# EAGLE design 406MHz detector (EAGLE 9.3.0)
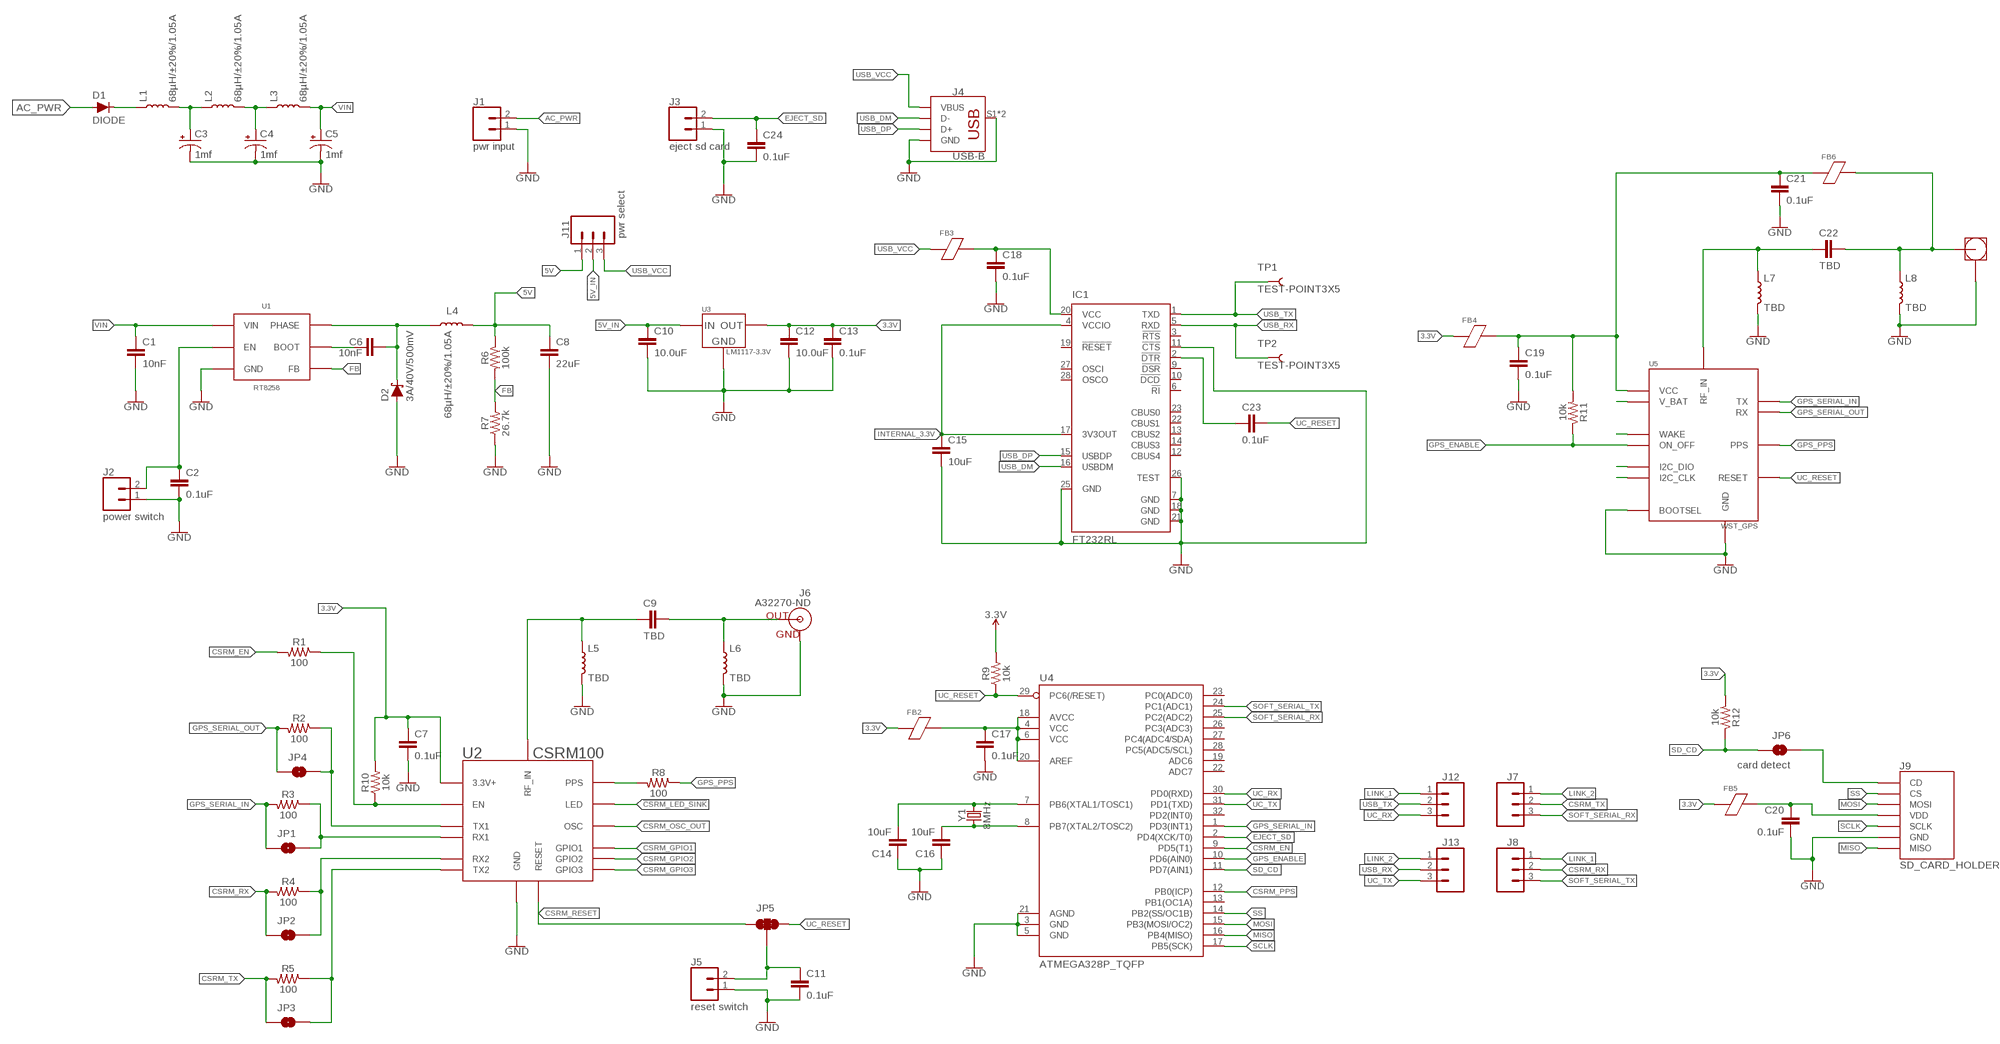
[diagram p0: schematic, sheet 1]

## Parts
C1  10nF  10NF-0603-50V-10%  [0603]
C2  0.1uF  0.18UF-0603-10V-10%  [0603]
C3  1mf  1000UF-RADIAL-5MM-35V-20%-KIT  [CPOL-RADIAL-5MM-10MM-KIT]
C4  1mf  1000UF-RADIAL-5MM-35V-20%-KIT  [CPOL-RADIAL-5MM-10MM-KIT]
C5  1mf  1000UF-RADIAL-5MM-35V-20%-KIT  [CPOL-RADIAL-5MM-10MM-KIT]
C6  10nF  10NF-0603-50V-10%  [0603]
C7  0.1uF  0.18UF-0603-10V-10%  [0603]
C8  22uF  0.18UF-0603-10V-10%  [0603]
C9  TBD  0.1UF-0603-25V-5%  [0603]
C10  10.0uF  1.0UF-1206-50V-10%  [1206]
C11  0.1uF  0.18UF-0603-10V-10%  [0603]
C12  10.0uF  1.0UF-1206-50V-10%  [1206]
C13  0.1uF  0.18UF-0603-10V-10%  [0603]
C14  10uF  10UF-1206-6.3V-20%  [1206]
C15  10uF  10UF-1206-6.3V-20%  [1206]
C16  10uF  10UF-1206-6.3V-20%  [1206]
C17  0.1uF  0.18UF-0603-10V-10%  [0603]
C18  0.1uF  0.18UF-0603-10V-10%  [0603]
C19  0.1uF  0.18UF-0603-10V-10%  [0603]
C20  0.1uF  0.18UF-0603-10V-10%  [0603]
C21  0.1uF  0.18UF-0603-10V-10%  [0603]
C22  TBD  0.1UF-0603-25V-5%  [0603]
C23  0.1uF  0.18UF-0603-10V-10%  [0603]
C24  0.1uF  0.18UF-0603-10V-10%  [0603]
D1  DIODE  [SMA-DIODE]
D2  3A/40V/500mV  DIODE-SCHOTTKY-B340A  [SMA-DIODE]
FB2  FERRITE_BEAD  [0603]
FB3  FERRITE_BEAD  [0603]
FB4  FERRITE_BEAD  [0603]
FB5  FERRITE_BEAD  [0603]
FB6  FERRITE_BEAD  [0603]
IC1  FT232RL  [SSOP28]
J1  pwr input  CONN_02LOCK  [1X02_LOCK]
J2  power switch  CONN_02  [1X02]
J3  eject sd card  CONN_02  [1X02]
J4  USB-B  [USB]
J5  reset switch  CONN_02  [1X02]
J6  A32270-ND  [A33270-ND]
J7  select jumper  CONN_03LOCK  [1X03_LOCK]
J8  select jumper  CONN_03LOCK  [1X03_LOCK]
J9  SD_CARD_HOLDER  [SD_CARD_HOLDER]
J10  SMA  [SMA_R/A]
J11  pwr select  CONN_03LOCK  [1X03_LOCK]
J12  select jumper  CONN_03LOCK  [1X03_LOCK]
J13  select jumper  CONN_03LOCK  [1X03_LOCK]
JP1  JUMPER-SMT_2_NO_SILK_ROUND  [SMT-JUMPER_2_NO_SILK_ROUND]
JP2  JUMPER-SMT_2_NO_SILK_ROUND  [SMT-JUMPER_2_NO_SILK_ROUND]
JP3  JUMPER-SMT_2_NO_SILK_ROUND  [SMT-JUMPER_2_NO_SILK_ROUND]
JP4  JUMPER-SMT_2_NO_SILK_ROUND  [SMT-JUMPER_2_NO_SILK_ROUND]
JP5  JUMPER-SMT_3_2-NC_TRACE_SILK  [SMT-JUMPER_3_2-NC_TRACE_SILK]
JP6  card detect  JUMPER-SMT_2_NO_SILK  [SMT-JUMPER_2_NO_SILK]
L1  68µH/±20%/1.05A  INDUCTOR-CR75-68UH  [CR75]
L2  68µH/±20%/1.05A  INDUCTOR-CR75-68UH  [CR75]
L3  68µH/±20%/1.05A  INDUCTOR-CR75-68UH  [CR75]
L4  68µH/±20%/1.05A  INDUCTOR-CR75-68UH  [CR75]
L5  TBD  INDUCTOR-0603-33NH  [0603]
L6  TBD  INDUCTOR-0603-33NH  [0603]
L7  TBD  INDUCTOR-0603-33NH  [0603]
L8  TBD  INDUCTOR-0603-33NH  [0603]
R1  100  10KOHM-0603-1/10W-1%  [0603]
R2  100  10KOHM-0603-1/10W-1%  [0603]
R3  100  10KOHM-0603-1/10W-1%  [0603]
R4  100  10KOHM-0603-1/10W-1%  [0603]
R5  100  10KOHM-0603-1/10W-1%  [0603]
R6  100k  10KOHM-0603-1/10W-1%  [0603]
R7  26.7k  26.7KOHM0603-1/10W-1%  [0603]
R8  100  10KOHM-0603-1/10W-1%  [0603]
R9  10k  10KOHM-0603-1/10W-1%  [0603]
R10  10k  10KOHM-0603-1/10W-1%  [0603]
R11  10k  10KOHM-0603-1/10W-1%  [0603]
R12  10k  10KOHM-0603-1/10W-1%  [0603]
TP1  TEST-POINT3X5  [PAD.03X.05]
TP2  TEST-POINT3X5  [PAD.03X.05]
U1  RT8258  [SOT23-6]
U2  CSRM100  [CSRM]
U3  LM1117-3.3V  [SOT223]
U4  ATMEGA328P_TQFP  [TQFP32-08]
U5  WST_GPS  [WST_GPS]
Y1  8MHz  CRYSTAL-8MHZSMD-HC49UP  [HC49UP]

## Nets
3.3V: C7.1 C12.1 C13.1 FB2.1 FB4.1 FB5.1 R9.2 R10.2 R12.2 U2.PWR_IN(3.3V+) U3.2(VOUT) U3.4(VOUT)
5V: C8.1 J11.1 L4.P$2 R6.1
5V_IN: C10.1 J11.2 U3.3(VIN)
406_IN [RF]: C9.2 L5.1 U2.406_IN(RF_IN)
!CSRM_LED_SINK: U2.LED
AC_PWR: D1.A J1.2
ANTENNA_CONNECTOR [RF]: C9.1 J6.OUT L6.1
BOOT: C6.1 U1.1(BOOT)
CSRM_EN: R1.2 U4.9(PD5(T1))
CSRM_GPIO1: U2.GPIO1
CSRM_GPIO2: U2.GPIO2
CSRM_GPIO3: U2.GPIO3
CSRM_OSC_OUT: U2.OSC_OUT(OSC)
CSRM_PPS: R8.2 U2.PPS U4.12(PB0(ICP))
CSRM_RESET: JP5.1 U2._RESET(RESET)
CSRM_RX: J8.2 JP2.1 R4.2
CSRM_TX: J7.2 JP3.1 R5.2
EJECT_SD: C24.1 J3.2 U4.2(PD4(XCK/T0))
FB: R6.2 R7.2 U1.3(FB)
GND: C1.2 C2.2 C3.- C4.- C5.- C7.2 C8.2 C10.2 C11.2 C12.2 C13.2 C14.1 C15.2 C16.1 C17.2 C18.2 C19.2 C20.2 C21.2 C24.2 D2.A IC1.7(GND) IC1.11(!CTS) IC1.18(GND) IC1.21(GND) IC1.25(GND) IC1.26(TEST) J1.1 J2.1 J3.1 J4.4(GND) J4.S1(SHIELD) J4.S2(SHIELD) J5.1 J6.GND1(GND) J6.GND2(GND) J6.GND3(GND) J6.GND4(GND) J9.GND1(GND) J9.GND2(GND) J9.P6(GND) J10.P$2 J10.P$3 J10.P$4 J10.P$5 L5.2 L6.2 L7.2 L8.2 R7.1 U1.2(GND) U2.GND U2.GND1(GND) U2.GND2(GND) U2.GND3(GND) U2.GND4(GND) U3.1(GND) U4.3(GND) U4.5(GND) U4.21(AGND) U5.P$1(GND) U5.P$3(GND) U5.P$9(BOOTSEL) U5.P$17(GND) U5.P$18(GND) U5.P$19(GND)
GPS_ANTENNA [RF]: C22.2 L7.1 U5.P$2(RF_IN)
GPS_CONNECTOR [RF]: C22.1 FB6.2 J10.P$1 L8.1
GPS_ENABLE: R11.1 U4.10(PD6(AIN0)) U5.P$15(ON_OFF)
GPS_PPS: R8.1 U5.P$14(PPS)
GPS_SERIAL_IN: JP1.1 R3.2 U4.1(PD3(INT1)) U5.P$10(TX)
GPS_SERIAL_OUT: JP4.1 R2.2 U5.P$11(RX)
HF_SWITCH: C6.2 D2.C L4.P$1 U1.6(PHASE)
INTERNAL_3.3V: C15.1 IC1.4(VCCIO) IC1.17(3V3OUT)
LINK_1: J8.1 J12.1
LINK_2: J7.1 J13.1
MISO: J9.P7(MISO) U4.16(PB4(MISO))
MOSI: J9.P3(MOSI) U4.15(PB3(MOSI/OC2))
N$1: JP4.2 R2.1 U2.TX1
N$4: JP1.2 R3.1 U2.RX1
N$5: JP2.2 R4.1 U2.RX2
N$6: JP3.2 R5.1 U2.TX2
N$8: R1.1 R10.1 U2.EN
N$10: C23.1 IC1.2(!DTR)
N$11: U5.P$6(V_BAT)
N$12: U5.P$16(WAKE)
N$13: J9.CD1(CD) J9.CD2(CD) JP6.1
N$14: U5.P$12(I2C_DIO)
N$15: D1.C L1.P$1
N$16: C3.+ L1.P$2 L2.P$1
N$17: C4.+ L2.P$2 L3.P$1
N$18: U5.P$13(I2C_CLK)
N$20: C18.1 FB3.1 IC1.20(VCC)
N$21: C14.2 U4.7(PB6(XTAL1/TOSC1)) Y1.2
N$22: C16.2 U4.8(PB7(XTAL2/TOSC2)) Y1.1
N$29: C19.1 C21.1 FB4.2 FB6.1 R11.2 U5.P$5(VCC)
N$31: C17.1 FB2.2 U4.4(VCC) U4.6(VCC) U4.18(AVCC) U4.20(AREF)
N$45: C20.1 FB5.2 J9.P4(VDD)
RESET: C11.1 J5.2 JP5.2
SCLK: J9.P5(SCLK) U4.17(PB5(SCK))
SD_CD: JP6.2 R12.1 U4.11(PD7(AIN1))
SOFT_SERIAL_RX: J7.3 U4.25(PC2(ADC2))
SOFT_SERIAL_TX: J8.3 U4.24(PC1(ADC1))
SS: J9.P2(CS) U4.14(PB2(SS/OC1B))
SUPPLY_ENABLE: C2.1 J2.2 U1.4(EN)
UC_RESET: C23.2 JP5.3 R9.1 U4.29(PC6(/RESET)) U5.P$4(RESET)
UC_RX: J12.3 U4.30(PD0(RXD))
UC_TX: J13.3 U4.31(PD1(TXD))
USB_DM: IC1.16(USBDM) J4.2(D-)
USB_DP: IC1.15(USBDP) J4.3(D+)
USB_RX: IC1.5(RXD) J13.2 TP2.P$1
USB_TX: IC1.1(TXD) J12.2 TP1.P$1
USB_VCC: FB3.2 J4.1(VBUS) J11.3
VIN: C1.1 C5.+ L3.P$2 U1.5(VIN)
Unconnected: IC1.3(!RTS) IC1.6(!RI) IC1.9(!DSR) IC1.10(!DCD) IC1.12(CBUS4) IC1.13(CBUS2) IC1.14(CBUS3) IC1.19(!RESET) IC1.22(CBUS1) IC1.23(CBUS0) IC1.27(OSCI) IC1.28(OSCO) U4.13(PB1(OC1A)) U4.19(ADC6) U4.22(ADC7) U4.23(PC0(ADC0)) U4.26(PC3(ADC3)) U4.27(PC4(ADC4/SDA)) U4.28(PC5(ADC5/SCL)) U4.32(PD2(INT0))

## Library data of the parts
C1 C6 = SparkFun-Capacitors:10NF: 0.01uF/10nF/10,000pF ceramic capacitors A capacitor is a passive two-terminal electrical component used to store electrical energy temporarily in an electric field. CAP-09321; PROD_ID: CAP-00867
C2 C7 C8 C11 C13 C17-C21 C23 C24 = SparkFun-Capacitors:0.18UF: 0.18µF ceramic capacitor A capacitor is a passive two-terminal electrical component used to store electrical energy temporarily in an electric field.; PROD_ID: CAP-12380; VALUE: 0.18uF
C3-C5 = SparkFun-Capacitors:1000UF: 1,000µF/1mF ceramic capacitors A capacitor is a passive two-terminal electrical component used to store electrical energy temporarily in an electric field. CAP-08070; PROD_ID: CAP-09538
C9 C22 = SparkFun-Capacitors:0.1UF: 0.1µF ceramic capacitors A capacitor is a passive two-terminal electrical component used to store electrical energy temporarily in an electric field.; PROD_ID: CAP-08604; VALUE: 0.1uF
C10 C12 = SparkFun-Capacitors:1.0UF: 1µF ceramic capacitors A capacitor is a passive two-terminal electrical component used to store electrical energy temporarily in an electric field.; PROD_ID: CAP-09822; VALUE: 1.0uF
C14-C16 = SparkFun-Capacitors:10UF: 10.0µF ceramic capacitors A capacitor is a passive two-terminal electrical component used to store electrical energy temporarily in an electric field.; PROD_ID: CAP-10057
D1 = capstone:DIODE
D2 = SparkFun-DiscreteSemi:DIODE-SCHOTTKY: Schottky diode A Schottky diode is a semiconductor diode which has a low forward voltage drop and a very fast switching action.; PROD_ID: DIO-09886
FB2-FB6 = capstone:FERRITE_BEAD: HZ0603B112R-10
IC1 = ftdichip:FT232R: Source: http://www.ftdichip.com/Documents/DataSheets/DS_FT232R_v104.pdf; MPN: FT232RL; OC_FARNELL: 1146032; OC_NEWARK: 91K9918
J1-J3 J5 = SparkFun-Connectors:CONN_02: Multi connection point. Often used as Generic Header-pin footprint for 0.1 inch spaced/style header connections On any of the 0.1 inch spaced packages, you can populate with these: Break Away Headers - Straight <https://www.sparkfun.com/products/116> (PRT-00116) Break Away Male Headers - Right Angle <https://www.sparkfun.com/products/553> (PRT-00553) Female Headers <https://www.sparkfun.com/products/115> (PRT-00115) Break Away Headers - Machine Pin <https://www.sparkfun.com/products/117> (PRT-00117) Break Away Female Headers - Swiss Machine Pin <https://www.sparkfun.com/products/743> (PRT-00743) For SCREWTERMINALS and SPRING TERMINALS visit here: Screw Terimnals on SparkFun.com <https://www.sparkfun.com/search/results?term=Screw+Terminals> (5mm/3.5mm/2.54mm spacing) This device is also useful as a general connection point to wire up your design to another part of your project. Our various solder wires solder well into these plated through hole pads. Hook-Up Wire - Assortment (Stranded, 22 AWG) <https://www.sparkfun.com/products/11375> (PRT-11375) Hook-Up Wire - Assortment (Solid Core, 22 AWG) <https://www.sparkfun.com/products/11367> (PRT-11367) View the entire wire category on our website here <https://www.sparkfun.com/categories/141> Special notes: Molex polarized connector foot print use with: PRT-08233 with associated crimp pins and housings. 2.54_SCREWTERM for use with PRT-10571. 3.5mm Screw Terminal footprints for PRT-08084 5mm Screw Terminal footprints for use with PRT-08432
J4 = capstone:USB-B
J6 = capstone:A32270-ND
J7 J8 J11-J13 = SparkFun-Connectors:CONN_03: Multi connection point. Often used as Generic Header-pin footprint for 0.1 inch spaced/style header connections On any of the 0.1 inch spaced packages, you can populate with these: Break Away Headers - Straight <https://www.sparkfun.com/products/116> (PRT-00116) Break Away Male Headers - Right Angle <https://www.sparkfun.com/products/553> (PRT-00553) Female Headers <https://www.sparkfun.com/products/115> (PRT-00115) Break Away Headers - Machine Pin <https://www.sparkfun.com/products/117> (PRT-00117) Break Away Female Headers - Swiss Machine Pin <https://www.sparkfun.com/products/743> (PRT-00743) Stackable Header - 3 Pin (Female, 0.1") <https://www.sparkfun.com/products/13875> (PRT-13875) For SCREWTERMINALS and SPRING TERMINALS visit here: Screw Terimnals on SparkFun.com <https://www.sparkfun.com/search/results?term=Screw+Terminals> (5mm/3.5mm/2.54mm spacing) This device is also useful as a general connection point to wire up your design to another part of your project. Our various solder wires solder well into these plated through hole pads. Hook-Up Wire - Assortment (Stranded, 22 AWG) <https://www.sparkfun.com/products/11375> (PRT-11375) Hook-Up Wire - Assortment (Solid Core, 22 AWG) <https://www.sparkfun.com/products/11367> (PRT-11367) View the entire wire category on our website here <https://www.sparkfun.com/categories/141> Special notes: Molex polarized connector foot print use with SKU : PRT-08232 with associated crimp pins and housings.
J9 = capstone:SD_CARD_HOLDER: this is the sd card slot holder part number MEM2061
J10 = capstone:SMA
JP1-JP4 JP6 = SparkFun-Jumpers:JUMPER-SMT_2_NO: Normally open jumper This jumper has two pads in close proximity to each other. Apply solder to close the connection. Round pads are easier to solder for beginners, but are a lot larger. SparkFun Product that uses the round pads: SparkFun EL Sequencer <https://www.sparkfun.com/products/12781>
JP5 = SparkFun-Jumpers:JUMPER-SMT_3_2-NC_TRACE: Normally closed trace jumper (2 of 2 connections) This jumper has a trace between all three pads so they are normally closed (NC). Use a razor knife to open the connection(s). For best results follow the IPC guidelines for cutting traces: Cutout at least 0.063 mm (0.005 in). Remove all loose material to clean up the cut area. Seal the cut with an approved epoxy. Reapply solder to reclose the connection(s).
L1-L4 = SparkFun-Coils:INDUCTOR: Inductors Resist changes in electrical current. Basically a coil of wire. SparkFun Products: SparkFun Load Cell Amplifier - HX711 <https://www.sparkfun.com/products/13879> IOIO-OTG - V2.2 <https://www.sparkfun.com/products/13613>; PROD_ID: NDUC-09739
L5-L8 = SparkFun-Coils:INDUCTOR: Inductors Resist changes in electrical current. Basically a coil of wire. SparkFun Products: SparkFun Load Cell Amplifier - HX711 <https://www.sparkfun.com/products/13879> IOIO-OTG - V2.2 <https://www.sparkfun.com/products/13613>; PROD_ID: NDUC-07874; VALUE: 33nH/±5%/500mA
R1-R6 R8 = SparkFun-Resistors:10KOHM: 10kΩ resistor A resistor is a passive two-terminal electrical component that implements electrical resistance as a circuit element. Resistors act to reduce current flow, and, at the same time, act to lower voltage levels within circuits. - Wikipedia; PROD_ID: RES-00824; VALUE: 10k
R7 = SparkFun-Resistors:26.7KOHM: 26.7kΩ resistor A resistor is a passive two-terminal electrical component that implements electrical resistance as a circuit element. Resistors act to reduce current flow, and, at the same time, act to lower voltage levels within circuits. - Wikipedia; PROD_ID: RES-12186
R9-R12 = SparkFun-Resistors:10KOHM: 10kΩ resistor A resistor is a passive two-terminal electrical component that implements electrical resistance as a circuit element. Resistors act to reduce current flow, and, at the same time, act to lower voltage levels within circuits. - Wikipedia; PROD_ID: RES-00824
TP1 TP2 = SparkFun-Connectors:TEST-POINT: SparkFun Test Points Bare copper test points for troubleshooting or In-Circuit-Testing. These are used by our Production team for verifying production board runs using pogo-pins on test beds. SparkFun Products: SparkFun LSM9DS1 Breakout <https://www.sparkfun.com/products/13284> SparkFun PSOC <https://www.sparkfun.com/products/13714> SparkFun Load Cell Amplifier <https://www.sparkfun.com/products/13879>
U1 = capstone:RT8258
U2 = capstone:CSRM100
U3 = capstone:LM1117-3.3V
U4 = SparkFun-IC-Microcontroller:ATMEGA328P_TQFP: Popular 328P in QFP Storefront component: ATmega328 - TQFP <https://www.sparkfun.com/products/13448> (COM-13448) Datasheet <http://www.sparkfun.com/datasheets/Components/SMD/ATMega328.pdf> SparkFun Products SparkFun RedBoard - Programmed with Arduino <https://www.sparkfun.com/products/12757> (DEV-12757) Arduino Pro Mini 328 - 5V/16MHz <https://www.sparkfun.com/products/11113> (DEV-11113) Arduino Pro Mini 328 - 3.3V/8MHz <https://www.sparkfun.com/products/11114> (DEV-11114) SparkFun OpenLog <https://www.sparkfun.com/products/13712> (DEV-13712) SparkFun MicroView - OLED Arduino Module <https://www.sparkfun.com/products/12923> (DEV-12923) SparkFun Digital Sandbox <https://www.sparkfun.com/products/12651> (DEV-12651) SparkFun PicoBoard <https://www.sparkfun.com/products/11888> (WIG-11888) Arduino Fio <https://www.sparkfun.com/products/10116> (DEV-10116) LilyPad Arduino 328 Main Board <https://www.sparkfun.com/products/13342> (DEV-13342) SparkFun RedStick <https://www.sparkfun.com/products/13741> (DEV-13741) LilyPad MP3 <https://www.sparkfun.com/products/11013> (DEV-11013) LilyPad Arduino SimpleSnap <https://www.sparkfun.com/products/10941> (DEV-10941) SparkFun Stepoko <https://www.sparkfun.com/products/13899> (ROB-13899) SparkFun Geiger Counter <https://www.sparkfun.com/products/11345> (SEN-11345) SparkFun EL Sequencer <https://www.sparkfun.com/products/12781> (COM-12781) Arduino Pro 328 - 5V/16MHz <https://www.sparkfun.com/products/10915> (DEV-10915) CryptoCape <https://www.sparkfun.com/products/12773> (DEV-12773) SparkFun IR Thermometer Evaluation Board - MLX90614 <https://www.sparkfun.com/products/10740> (SEN-10740) SparkFun RedBot Mainboard <https://www.sparkfun.com/products/12097> (ROB-12097) Arduino Pro 328 - 3.3V/8MHz <https://www.sparkfun.com/products/10914> (DEV-10914) SparkFun Block for Intel® Edison - Arduino <https://www.sparkfun.com/products/13036> (DEV-13036) SparkFun Simon Says - Surface Mount Soldering Kit <https://www.sparkfun.com/products/10935> (KIT-10935) SparkFun 7-Segment Serial Display - Red <https://www.sparkfun.com/products/11441> (COM-11441) SparkFun 7-Segment Serial Display - White <https://www.sparkfun.com/products/11629> (COM-11629) SparkFun 7-Segment Serial Display - Yellow <https://www.sparkfun.com/products/11443> (COM-11443) SparkFun 7-Segment Serial Display - Kelly Green <https://www.sparkfun.com/products/11440> (COM-11440) SparkFun 7-Segment Serial Display - Blue <https://www.sparkfun.com/products/11442> (COM-11442) SparkFun OpenSegment Serial Display - 20mm (Blue) <https://www.sparkfun.com/products/11647> (COM-11647) SparkFun OpenSegment Serial Display - 20mm (Green) <https://www.sparkfun.com/products/11646> (COM-11646) SparkFun OpenSegment Serial Display - 20mm (White) <https://www.sparkfun.com/products/11648> (COM-11648) SparkFun OpenSegment Serial Display - 20mm (Red) <https://www.sparkfun.com/products/11644> (COM-11644) SparkFun OpenSegment Serial Display - 20mm (Yellow) <https://www.sparkfun.com/products/11645> (COM-11645) SparkFun OpenSegment Shield <https://www.sparkfun.com/products/13190> (DEV-13190); PROD_ID: IC-09069
U5 = capstone:WST_GPS
Y1 = SparkFun-Clocks:CRYSTAL-8MHZ: 8MHz Crystal Datasheet Example <http://www.futureelectronics.com/en/technologies/electromechanical/timing-devices/crystals/Pages/6008189-ABM3B-8.000MHZ-B2-T.aspx?IM=0> Frequency: 8MHz Frequency Tolerance: ±20ppm Load Capacitance: 18pF SparkFun Products: Pro Micro -3.3V/8MHz <https://www.sparkfun.com/products/12587> WAV Trigger <https://www.sparkfun.com/products/13660>; PROD_ID: XTAL-11706

## Net classes
0 defaults: width 0.305 mm, drill 0.203 mm, clearance 0.203 mm
1 RF: width 1.499 mm, clearance 3.048 mm

## Board
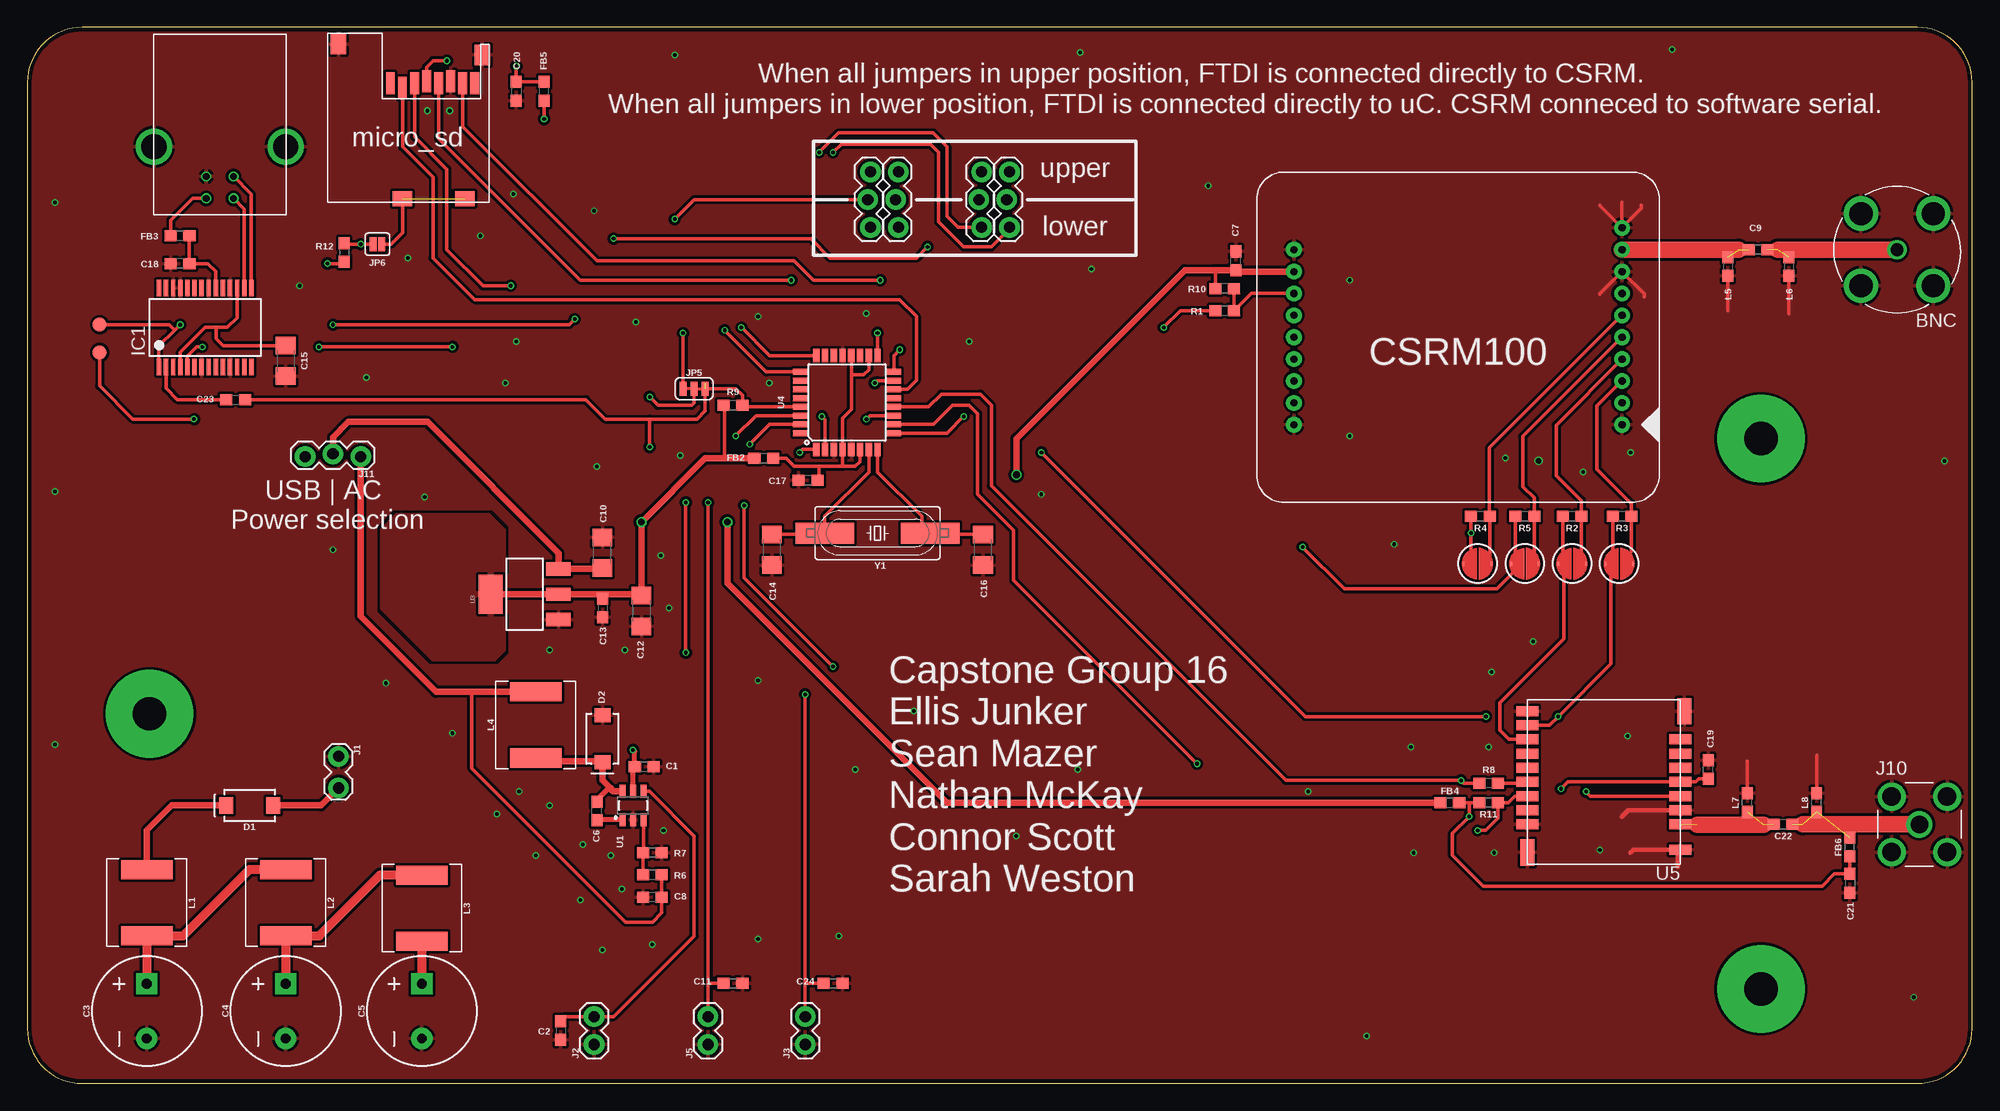
[diagram p1: board, top side]
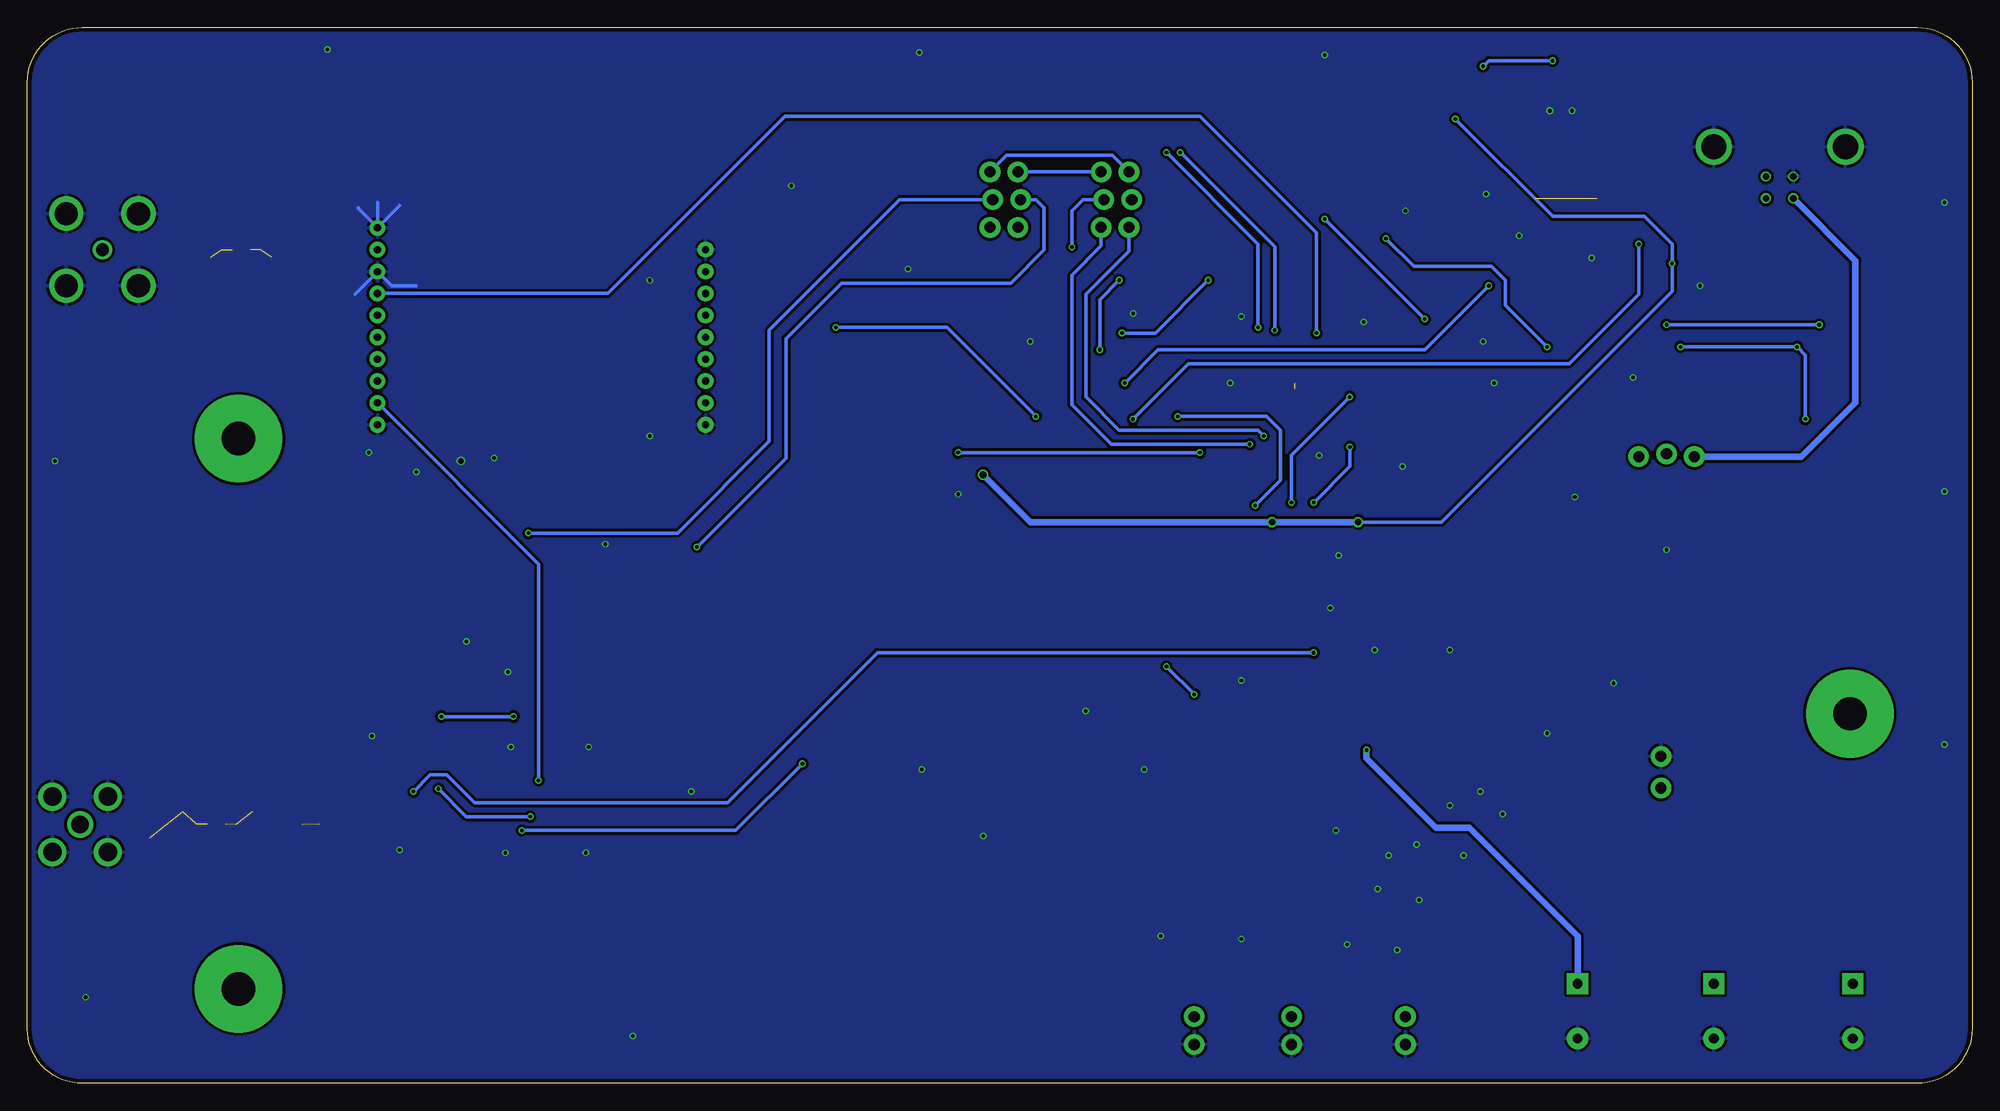
[diagram p2: board, bottom side, seen from below]

Size 177.8 x 96.52 mm. Coordinates in mm from the lower left corner, seen from the top.
Outline: 0,91.52 0,5 arc90 5,0 172.8,0 arc90 177.8,5 177.8,91.52 arc90 172.8,96.52 5,96.52 arc90 0,91.52
Copper layers (1*16): Top 0.035559375mm / dielectric 1.6mm / Bottom 0.035559375mm
Design rules "eagle *": minimum track width 6mil, minimum drill 10mil, track to track 6mil, track to pad 6mil, pad to pad 6mil, via to via 6mil, smd to smd 6mil, copper to edge 15mil, drill to drill 6mil, minimum pad ring 5mil, minimum via ring 5mil, stop-mask expansion 2.5mil, vias tented up to drill 15mil, thermal gap 10mil

### Footprints (pad centres in the part's own frame; a part is rotated, then mirrored left to right if it is on the bottom)
0603 = smd 1.1 x 1: 1 -0.85,0; 2 0.85,0
CPOL-RADIAL-5MM-10MM-KIT = drill 0.9 pad 1.93 square: + 2.5,0 | drill 0.9 pad 1.93: - -2.5,0
1206 = smd 1.6 x 1.8: 1 -1.4,0; 2 1.4,0
SMA-DIODE = smd 1.27 x 1.47: A -2.15,0; C 2.15,0
SSOP28 = smd 0.4 x 1.5: 1 -4.225,-3.625; 2 -3.575,-3.625; 3 -2.925,-3.625; 4 -2.275,-3.625; 5 -1.625,-3.625; 6 -0.975,-3.625; 7 -0.325,-3.625; 8 0.325,-3.625; 9 0.975,-3.625; 10 1.625,-3.625; 11 2.275,-3.625; 12 2.925,-3.625; 13 3.575,-3.625; 14 4.225,-3.625; 15 4.225,3.625; 16 3.575,3.625; 17 2.925,3.625; 18 2.275,3.625; 19 1.625,3.625; 20 0.975,3.625; 21 0.325,3.625; 22 -0.325,3.625; 23 -0.975,3.625; 24 -1.625,3.625; 25 -2.275,3.625; 26 -2.925,3.625; 27 -3.575,3.625; 28 -4.225,3.625
1X02_LOCK = drill 1.016 pad 1.88: 1 -0.178,0; 2 2.718,0
1X02 = drill 1.016 pad 1.88: 1 0,0; 2 2.54,0
USB = drill 0.6: 1 7.27,4.71; 2 4.77,4.71; 3 4.77,2.71; 4 7.27,2.71 | drill 2.3: S1 0,0; S2 12.04,0
A33270-ND = drill 2.11: GND1 0,0; GND2 6.6,0; GND3 0,-6.6; GND4 6.6,-6.6 | drill 1.17: OUT 3.3,-3.3
1X03_LOCK = drill 1.016 pad 1.88: 1 0,0.127; 2 2.54,-0.127; 3 5.08,0.127
SD_CARD_HOLDER = smd 1.8 x 1.4: CD1 -11.55,14.15; CD2 -5.85,14.15 | smd 1.4 x 1.9: GND1 -13.15,1; GND2 0,0 | smd 0.8 x 2: P1 -4.75,3.6; P2 -5.85,4; P3 -6.95,3.6; P4 -8.05,3.4; P5 -9.15,3.6; P6 -10.25,3.4; P7 -11.35,3.6; P8 -12.45,3.6
SMA_R/A = drill 1.6: P$1 0,0 | drill 1.7: P$2 -2.54,2.54; P$3 2.54,2.54; P$4 2.54,-2.54; P$5 -2.54,-2.54
SMT-JUMPER_2_NO_SILK_ROUND = smd 0.152 x 0.305: 1 -1.27,0; 2 1.27,0
SMT-JUMPER_3_2-NC_TRACE_SILK = smd 0.635 x 1.27: 1 -1.016,0; 2 0,0; 3 1.016,0
SMT-JUMPER_2_NO_SILK = smd 0.635 x 1.27: 1 -0.406,0; 2 0.406,0
CR75 = smd 1.75 x 4.7: P$1 -3.025,0; P$2 3.025,0
PAD.03X.05 = smd 1.27 x 1.27: P$1 0,0
SOT23-6 = smd 0.55 x 1.2: 1 0.95,1.3; 2 0,1.3; 3 -0.95,1.3; 4 -0.95,-1.3; 5 0,-1.3; 6 0.95,-1.3
CSRM = drill 0.65 pad 1.422: 406_IN 0,-16; _RESET 0,-12; EN 30,-12; GND 30,-16; GND1 0,0; GND2 0,-14; GND3 0,-18; GND4 30,0; GPIO1 30,-8; GPIO2 30,-6; GPIO3 30,-4; LED 30,-10; OSC_OUT 30,-2; PPS 0,-2; PWR_IN 30,-14; RX1 0,-4; RX2 0,-10; TX1 0,-6; TX2 0,-8
SOT223 = smd 1.219 x 2.235: 1 -2.311,-3.099; 2 0,-3.099; 3 2.311,-3.099 | smd 3.6 x 2.2: 4 0,3.099
TQFP32-08 = smd 1.27 x 0.559: 1 -4.293,2.8; 2 -4.293,2; 3 -4.293,1.2; 4 -4.293,0.4; 5 -4.293,-0.4; 6 -4.293,-1.2; 7 -4.293,-2; 8 -4.293,-2.8; 17 4.293,-2.8; 18 4.293,-2; 19 4.293,-1.2; 20 4.293,-0.4; 21 4.293,0.4; 22 4.293,1.2; 23 4.293,2; 24 4.293,2.8 | smd 0.559 x 1.27: 9 -2.8,-4.293; 10 -2,-4.293; 11 -1.2,-4.293; 12 -0.4,-4.293; 13 0.4,-4.293; 14 1.2,-4.293; 15 2,-4.293; 16 2.8,-4.293; 25 2.8,4.293; 26 2,4.293; 27 1.2,4.293; 28 0.4,4.293; 29 -0.4,4.293; 30 -1.2,4.293; 31 -2,4.293; 32 -2.8,4.293
WST_GPS = smd 2 x 0.92: P$1 0,0; P$2 0,-2.335; P$3 0,-3.63; P$4 0,-4.925; P$5 0,-6.22; P$6 0,-7.515; P$7 0,-8.81; P$8 0,-10.105; P$9 14,-12.695; P$10 14,-11.4; P$11 14,-10.105; P$12 14,-8.81; P$13 14,-7.515; P$14 14,-6.22; P$15 14,-4.925; P$16 14,-3.63; P$17 14,-2.335 | smd 1.3 x 2.4: P$18 -0.35,-12.67; P$19 14,0.23
HC49UP = smd 5.334 x 1.93: 1 -4.826,0; 2 4.826,0

### Placement (x,y rotation side)
C1  56.39,28.96 0 top
C2  48.77,4.83 270 top
C3  10.92,6.6 90 top
C4  23.62,6.6 90 top
C5  36.07,6.6 90 top
C6  52.07,24.89 90 top
C7  110.49,75.18 90 top
C8  57.15,17.02 180 top
C9  158.24,76.2 180 top
C10  52.58,48.51 90 top
C11  64.52,9.14 0 top
C12  56.13,43.18 270 top
C13  52.58,43.43 270 top
C14  68.07,48.77 90 top
C15  23.62,66.04 270 top
C16  87.38,48.77 90 top
C17  71.37,55.12 180 top
C18  13.97,74.93 180 top
C19  153.67,28.7 90 top
C20  44.7,90.68 270 top
C21  166.62,18.29 270 top
C22  160.53,23.67 180 top
C23  19.05,62.48 0 top
C24  73.66,9.14 0 top
D1  20.32,25.4 180 top
D2  52.58,31.5 270 top
FB2  67.31,57.15 0 top
FB3  13.97,77.47 180 top
FB4  130.05,25.65 0 top
FB5  47.24,90.68 90 top
FB6  166.62,21.59 90 top
IC1  16.26,69.09 0 top
J1  28.45,29.72 270 top
J2  51.82,3.56 90 top
J3  71.12,3.56 90 top
J4  23.62,85.6 180 top
J5  62.23,3.56 90 top
J6  167.64,79.5 0 top
J7  87.12,83.31 270 top
J8  89.66,83.31 270 top
J9  28.45,95 180 top
J10  172.97,23.67 0 top
J11  30.48,57.4 180 top
J12  76.96,83.31 270 top
J13  79.5,83.31 270 top
JP1  145.54,47.5 0 top
JP2  132.59,47.5 0 top
JP3  136.91,47.5 0 top
JP4  141.22,47.5 0 top
JP5  60.96,63.5 0 top
JP6  32,76.71 180 top
L1  10.92,16.51 270 top
L2  23.62,16.51 270 top
L3  36.07,16 270 top
L4  46.48,32.77 90 top
L5  155.45,74.68 270 top
L6  161.04,74.68 270 top
L7  157.23,25.65 90 top
L8  163.58,25.65 90 top
R1  109.47,70.61 180 top
R2  141.22,51.82 180 top
R3  145.8,51.82 180 top
R4  132.84,51.82 180 top
R5  136.91,51.82 180 top
R6  57.15,19.05 180 top
R7  57.15,21.08 180 top
R8  133.6,27.43 180 top
R9  64.52,61.98 180 top
R10  109.47,72.64 180 top
R11  133.6,25.65 180 top
R12  28.96,75.95 270 top
TP1  6.6,69.34 0 top
TP2  6.6,66.8 0 top
U1  55.37,25.4 180 top
U2  145.8,60.2 180 top
U3  45.47,44.7 90 top
U4  74.93,62.23 90 top
U5  151.13,21.34 180 top
Y1  77.72,50.29 180 top

### Tracks (layer width: path | path; a pad name or v marks a point on that pad's centre or on a via)
3.3V  (via drill 0.35, 0.61)
  Top 0.305: FB5.1 v47.24,88.14 | v27.43,74.93 28.79,74.93 R12.2 | R9.2 63.75,61.89 63.75,57.15 | R10.2 108.62,74.17 108.46,74.33
  Top 0.61: 52.58,44.7 U3.2 U3.4 | 52.58,44.7 56.01,44.7 C12.1 v56.13,51.31 61.98,57.15 63.75,57.15 FB2.1 | C13.1 52.58,44.7 | U2.PWR_IN 110.63,74.2 C7.1 108.46,74.33 105.83,74.33 90.42,58.93 v90.42,55.63 | FB4.1 84.07,25.65 64.01,45.72 v64.01,51.31
  Bottom 0.305: v47.24,88.14 38.35,79.25 29.97,79.25 27.43,76.71 v27.43,74.93 27.43,72.39 48.51,51.31 v56.13,51.31
  Bottom 0.61: v56.13,51.31 v64.01,51.31 86.11,51.31 v90.42,55.63
  pour Top (isolate 0.254): 43.43,39.62 43.43,50.55 42.16,51.82 33.78,51.82 32.51,50.55 32.51,43.43 37.08,38.86 42.67,38.86
5V
  Top 0.305: R6.1 C8.1 | 57.91,16.93 C8.1 | C8.1 58,15.58 57.15,14.73 54.71,14.73 40.64,28.8 40.64,35.79
  Top 0.61: L4.P$2 40.64,35.79 37.36,35.79 30.48,42.67 J11.1
5V_IN
  Top 0.61: J11.2 27.94,59.05 29.34,60.45 36.58,60.45 48.56,48.46 U3.3 52.48,47.02 C10.1
406_IN  (2 unrouted)
  Top 1.499: U2.406_IN 156.46,76.2
AC_PWR
  Top 0.61: J1.2 26.85,25.4 D1.A
ANTENNA_CONNECTOR  (2 unrouted)
  Top 1.499: J6.OUT 160.02,76.2
BOOT
  Top 0.457: U1.1 52.13,24.1 C6.1
CSRM_EN  (via drill 0.33)
  Top 0.305: R1.2 105.41,70.61 v103.89,69.09 | v85.6,60.96 84.07,59.43 U4.9
  Bottom 0.305: v103.89,69.09 93.73,69.09 v85.6,60.96
CSRM_PPS  (via drill 0.33)
  Top 0.305: R8.2 131.32,27.43 v131.06,27.69 115.06,27.69 88.14,54.61 88.14,61.98 87.12,62.99 83.57,62.99 82.4,61.83 U4.12
  Bottom 0.305: U2.PPS 131.06,47.47 v131.06,27.69
CSRM_RESET  (via drill 0.33)
  Top 0.305: v59.94,68.58 JP5.1
  Bottom 0.305: U2._RESET 124.71,72.2 108.52,88.39 70.61,88.39 59.94,77.72 v59.94,68.58
CSRM_RX  (via drill 0.33)
  Top 0.305: R4.2 v131.99,50.29 131.99,47.33 | 131.99,47.33 132.08,47.24 | 131.99,47.33 131.83,47.5 JP2.1
  Bottom 0.305: J8.2 98.04,80.77 109.98,68.83 109.98,58.67 118.36,50.29 v131.99,50.29
CSRM_TX  (via drill 0.33)
  Top 0.305: 136.4,47.24 134.37,45.21 120.4,45.21 v116.59,49.02 | 136.4,47.24 136.4,47.75 | R5.2 136.06,47.59 | 136.06,47.59 136.4,47.24 | JP3.1 135.97,47.5 136.06,47.59
  Bottom 0.305: J7.2 85.6,80.77 84.84,80.01 84.84,76.2 87.88,73.15 103.38,73.15 108.46,68.07 108.46,57.15 v116.59,49.02
EJECT_SD  (via drill 0.33)
  Top 0.305: U4.2 72.93,60.67 v72.64,60.96 | v65.53,52.83 65.53,46.23 v73.66,38.1 | v71.12,35.56 71.12,9.14 | 71.12,9.14 J3.2 | C24.1 71.12,9.14
  Bottom 0.305: v65.53,52.83 63.25,55.12 63.25,59.69 64.52,60.96 v72.64,60.96 | v73.66,38.1 v71.12,35.56
FB
  Top 0.305: U1.3 56.32,21.1 R7.2 R6.2
GND  (via drill 0.33, 0.35, 0.5)
  Top 0.305: L7.2 157.23,29.46 | L8.2 163.58,29.97 | L5.2 155.45,70.61 | L6.2 161.04,70.36 | 143.76,72.14 143.76,72.17 U2.GND2 147.83,72.17 147.83,71.88 | U2.GND3 143.76,80.23 143.76,80.26 | U2.GND3 145.8,80.52 | U2.GND3 147.57,79.98 147.57,80.26
  Top 0.406: U5.P$3 146.38,24.97 145.8,24.38 | 150.88,19.81 150.88,21.08 U5.P$1 146.81,21.34 146.56,21.08
  Bottom 0.305: 142.24,72.9 144.5,72.9 U2.GND2 145.8,74.17 147.83,72.14 | U2.GND3 143.76,80.23 143.76,80.26 | U2.GND3 145.8,80.52 | U2.GND3 147.57,79.98 147.57,80.01
  other vias: 138.18,56.9 38.61,88.9 36.58,88.9 124.97,49.28 146.3,31.75 143.76,21.34 137.67,40.39 133.6,30.73 133.86,37.59 134.11,21.08 126.75,21.08 126.49,30.73 117.09,26.67 54.61,39.62 47.75,39.62 36.32,53.59 32.77,36.58 27.94,48.77 57.91,48.26 58.67,43.43 52.07,56.39 59.69,57.4 67.82,64.01 76.71,70.36 66.8,70.1 24.89,72.9 34.8,75.44 41.4,77.47 44.45,81.28 120.9,59.18 120.9,73.41 146.56,57.66 142.24,55.88 135.13,57.15 90.42,22.61 75.69,28.7 81.03,34.04 96.01,28.7 66.8,36.83 66.8,13.21 74.17,13.46 52.58,12.19 38.86,32 47.75,25.4 44.96,26.67 42.93,24.64 46.48,20.83 50.55,16.76 54.36,17.78 53.34,20.83 50.8,21.84 57.15,12.7 58.17,23.11 55.63,69.6 44.7,67.82 43.69,64.01 30.99,64.52 92.71,53.85 86.11,67.82 97.28,74.42 107.95,82.04 2.54,30.99 2.54,80.52 51.82,79.76 122.43,4.32 172.47,7.87 175.26,56.9 150.37,94.49 96.27,94.23 59.18,93.98 2.54,54.1
  pour Top (isolate 0.254, rank 2): 5,0 172.8,0 arc90 177.8,5 177.8,91.52 arc90 172.8,96.52 5,96.52 arc90 0,91.52 0,5 arc90
  pour Bottom (isolate 0.254, rank 2): 5,0 172.8,0 arc90 177.8,5 177.8,91.52 arc90 172.8,96.52 5,96.52 arc90 0,91.52 0,5 arc90
GPS_ANTENNA  (3 unrouted)
  Top 1.499: 152.65,23.62 158.75,23.62
GPS_CONNECTOR  (3 unrouted)
  Top 1.499: J10.P$1 162.31,23.67
GPS_ENABLE  (via drill 0.33, 0.35)
  Top 0.305: U5.P$15 135.99,26.26 135.38,25.65 R11.1 134.45,24.22 133.35,23.11 v132.59,23.11 | U4.10 82.84,60.23 84.58,61.98 86.11,61.98 86.87,61.21 86.87,53.85 90.17,50.55 90.17,45.97 v106.93,29.21
  Bottom 0.305: v132.59,23.11 113.03,23.11 v106.93,29.21
GPS_PPS
  Top 0.305: R8.1 137.01,27.43 U5.P$14
GPS_SERIAL_IN  (via drill 0.35)
  Top 0.305: R3.2 144.95,47.66 144.78,47.5 JP1.1 144.78,46.99 144.78,38.35 v139.95,33.53 139.16,32.74 U5.P$10 | U4.1 70.89,57.94 v70.61,57.66 | v92.71,57.66 116.84,33.53 v133.35,33.53
  Bottom 0.305: v70.61,57.66 v92.71,57.66 | v139.95,33.53 v133.35,33.53
GPS_SERIAL_OUT
  Top 0.305: R2.2 140.37,47.92 140.08,47.62 | 140.08,47.62 JP4.1 | U5.P$11 135.44,31.44 134.62,32.26 134.62,34.8 140.46,40.64 140.46,47.24 140.08,47.62
HF_SWITCH
  Top 0.457: C6.2 52.07,25.91 53.21,27.05
  Top 0.61: U1.6 53.56,26.7 53.21,27.05 52.58,27.69 D2.C 52.46,29.46 46.76,29.46 L4.P$1
INTERNAL_3.3V
  Top 0.305: IC1.4 13.98,66.81 16.26,69.09 17.27,69.09 | 17.27,69.09 18.29,69.09 19.18,69.98 IC1.17 | C15.1 17.9,67.44 17.27,68.07 17.27,69.09
LINK_1
  Bottom 0.305: J12.1 78.61,84.84 88.27,84.84 J8.1
LINK_2
  Bottom 0.305: J7.1 J13.1
MISO  (via drill 0.35)
  Top 0.305: J9.P7 39.8,87.46 52.07,75.18 70.1,75.18 71.88,73.41 v77.98,73.41 | v79.76,67.06 79.22,66.52 U4.16
  Bottom 0.305: v77.98,73.41 79.76,71.63 v79.76,67.06
MOSI  (via drill 0.35)
  Top 0.305: v77.47,64.01 77.69,64.23 U4.15 | J9.P3 35.4,86.52 38.35,83.57 38.35,76.2 41.66,72.9 v44.2,72.9
  Bottom 0.305: v77.47,64.01 74.42,67.06 50.04,67.06 v44.2,72.9
N$1
  Top 0.305: U2.TX1 139.77,60.17 139.77,55.55 142.07,53.25 R2.1 142.07,47.92 JP4.2
N$4
  Top 0.305: U2.RX1 143.51,61.91 143.51,56.13 146.65,53 R3.1 146.65,48.6 146.05,48.01 146.05,47.5 JP1.2
N$5
  Top 0.305: U2.RX2 133.68,58.08 133.68,51.83 R4.1 133.69,47.66 JP2.2
N$6
  Top 0.305: U2.TX2 136.72,59.13 136.72,54.54 137.76,53.51 R5.1 137.76,47.92 JP3.2
N$7  (via drill 3.05 pad 8)
  other vias: 158.5,58.93
N$8
  Top 0.305: U2.EN 111.91,72.2 R1.1 R10.1
N$9  (via drill 3.05 pad 8)
  other vias: 11.18,33.78
N$10
  Top 0.305: IC1.2 12.68,63.52 13.72,62.48 C23.1
N$13  (1 unrouted)
  Top 0.305: JP6.1 33.27,76.71 34.3,77.73 J9.CD2
N$15
  Top 0.61: D1.C 13.21,25.4 10.92,23.11 L1.P$1
N$16
  Top 0.813: L2.P$1 23.6,19.56 20.32,19.56 14.25,13.48 L1.P$2 C3.+
N$17
  Top 0.813: C4.+ L2.P$2 26.69,13.48 32.26,19.05 36.05,19.05 L3.P$1
N$19  (via drill 3.05 pad 8)
  other vias: 158.5,8.64
N$20
  Top 0.305: FB3.1 C18.1 16.51,74.93 17.23,74.21 IC1.20
N$21
  Top 0.305: U4.7 76.93,55.85 72.9,51.82 Y1.2 72.77,50.17 C14.2
N$22
  Top 0.305: U4.8 77.73,55.87 81.79,51.82 81.79,50.29 Y1.1 82.67,50.17 C16.2
N$29  (via drill 0.33)
  Top 0.305: R11.2 131.83,25.65 | 131.83,25.65 FB4.2 | v140.21,26.92 140.84,27.56 U5.P$5 152.52,27.56 152.82,27.85 C19.1 | 131.83,25.65 v131.83,24.38 130.3,22.86 130.3,20.83 133.1,18.03 164.08,18.03 165.19,19.14 C21.1 FB6.1
  Bottom 0.305: v140.21,26.92 137.67,24.38 v131.83,24.38
N$31
  Top 0.305: FB2.2 69.34,57.15 70.1,56.39 72.39,56.39 | 72.39,56.39 74.53,56.39 | U4.6 76.13,56.83 75.69,56.39 74.53,56.39 | 74.53,56.39 U4.4 74.53,60.81 75.33,61.61 75.33,64.77 | 75.33,64.77 U4.20 | U4.18 76.93,65.25 76.45,64.77 75.33,64.77 | C17.1 72.39,55.28 72.39,56.39
N$45  (via drill 0.35)
  Top 0.305: v44.7,92.96 C20.1 FB5.2 | v38.35,93.47 37.08,93.47 36.5,92.89 J9.P4
  Bottom 0.305: v44.7,92.96 44.2,93.47 v38.35,93.47
RESET  (via drill 0.33)
  Top 0.305: JP5.2 60.96,62.23 60.71,61.98 57.66,61.98 v56.9,62.74 | v62.23,53.09 62.23,9.14 | 62.23,9.14 J5.2 | C11.1 62.23,9.14
  Bottom 0.305: v56.9,62.74 62.23,57.4 v62.23,53.09
SCLK  (via drill 0.35)
  Top 0.305: v77.72,68.58 U4.17 | J9.P5 37.6,86.35 50.55,73.41 v69.85,73.41
  Bottom 0.305: v77.72,68.58 74.68,68.58 v69.85,73.41
SD_CD  (via drill 0.35)
  Top 0.305: v76.71,60.71 77.03,61.03 U4.11 | JP6.2 v30.48,76.71 29.04,76.71 R12.1
  Bottom 0.305: v30.48,76.71 30.48,72.14 36.83,65.79 71.63,65.79 v76.71,60.71
SOFT_SERIAL_RX  (via drill 0.33)
  Top 0.305: U4.25 67.56,65.03 v63.75,68.83 | v72.39,85.09 74.17,86.87 82.8,86.87 84.07,85.6 84.07,79.25 85.09,78.23 J7.3
  Bottom 0.305: v63.75,68.83 63.75,76.45 v72.39,85.09
SOFT_SERIAL_TX  (via drill 0.33)
  Top 0.305: U4.24 67.84,66.52 v65.28,69.09 | v73.66,85.09 74.42,85.85 82.55,85.85 83.31,85.09 83.31,78.74 85.6,76.45 88.14,76.45 89.79,78.11 J8.3
  Bottom 0.305: v65.28,69.09 65.28,76.71 v73.66,85.09
SS
  Top 0.305: J9.P2 34.3,85.59 37.08,82.8 37.08,75.44 40.89,71.63 79.76,71.63 81.28,70.1 81.28,64.26 80.45,63.43 U4.14
SUPPLY_ENABLE
  Top 0.305: C2.1 49.14,6.1 J2.2 53.59,6.1 60.96,13.46 60.96,22.61 56.87,26.7 U1.4
UC_RESET  (via drill 0.33, 0.35)  (1 unrouted)
  Top 0.305: U4.29 65.51,61.83 R9.1 65.37,62.9 64.77,63.5 JP5.3 | C23.2 51.05,62.48 52.83,60.71 56.9,60.71 | 56.9,60.71 61.21,60.71 61.98,61.47 61.98,63.98 | U5.P$4 142.9,26.26 v142.49,26.67 | v60.2,53.09 v60.2,39.37 | v56.9,58.17 56.9,60.71
  Bottom 0.305: v142.49,26.67 140.97,28.19 139.45,28.19 136.91,25.65 113.79,25.65 100.08,39.37 v60.2,39.37 | v60.2,53.09 56.9,56.39 v56.9,58.17
UC_RX  (via drill 0.33)
  Top 0.305: v64.77,59.18 66.62,61.03 U4.30
  Bottom 0.305: J12.3 77.09,76.07 81.03,72.14 81.03,62.74 77.98,59.69 65.28,59.69 v64.77,59.18
UC_TX  (via drill 0.33)
  Top 0.305: v66.04,58.42 67.85,60.23 U4.31
  Bottom 0.305: J13.3 79.63,76.54 82.3,73.87 82.3,62.02 78.7,58.42 v66.04,58.42
USB_DM
  Top 0.305: J4.2 19.83,79.91 IC1.16
USB_DP
  Top 0.305: J4.3 20.48,81.26 IC1.15
USB_RX  (via drill 0.33)
  Top 0.305: IC1.5 14.63,66.45 15.49,67.31 v16,67.31 | TP2.P$1 6.6,63.75 9.65,60.71 v15.24,60.71 | v82.3,76.45 81.28,75.44 73.41,75.44 71.63,77.22 v53.59,77.22 | v38.86,67.31 v26.67,67.31
  Bottom 0.305: v26.67,67.31 v16,67.31 15.24,66.55 v15.24,60.71 | J13.2 81.28,80.77 82.3,79.76 v82.3,76.45 | v53.59,77.22 51.05,74.68 43.94,74.68 42.67,73.41 42.67,71.12 v38.86,67.31
USB_TX  (via drill 0.33, 0.35)
  Top 0.305: IC1.1 12.03,67.4 13.46,68.83 | 13.46,68.83 v13.97,69.34 | TP1.P$1 12.95,69.34 13.46,68.83 | J12.2 60.96,80.77 v59.18,78.99 | v50.04,69.85 49.53,69.34 v27.94,69.34
  Bottom 0.305: v27.94,69.34 v13.97,69.34 | v59.18,78.99 v50.04,69.85
USB_VCC
  Top 0.305: J4.1 15.1,80.89 13.12,78.91 FB3.2
  Bottom 0.61: J11.3 15.62,57.28 10.67,62.23 10.67,75.2 J4.1
VIN  (via drill 0.33)
  Top 0.457: U1.5 55.37,28.79 C1.1 55.54,30.31 v55.37,30.48
  Top 0.813: L3.P$2 C5.+
  Bottom 0.61: C5.+ 36.07,13.46 45.97,23.37 49.02,23.37 55.37,29.72 v55.37,30.48

### Text on the board
tPlace: When all jumpers in upper position, FTDI is connected directly to CSRM. | When all jumpers in lower position, FTDI is connected directly to uC. CSRM conneced to software serial. | upper | lower | USB | AC / Power selection | Capstone Group 16 / Ellis Junker / Sean Mazer / Nathan McKay / Connor Scott / Sarah Weston